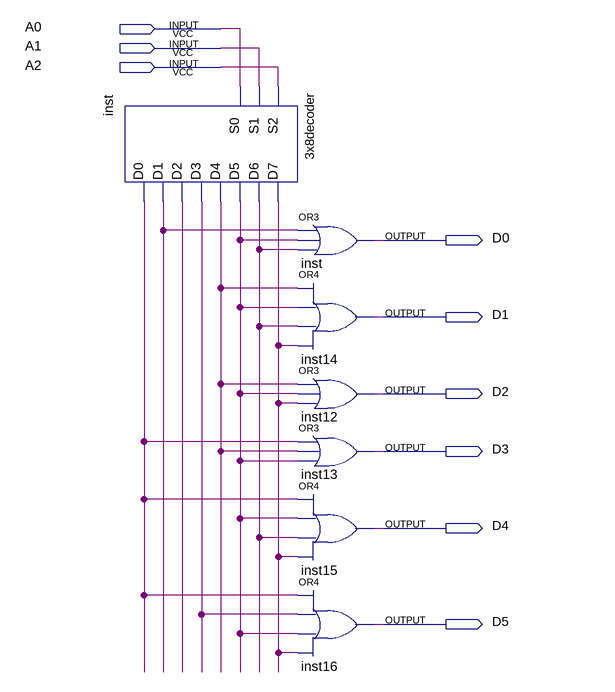
[diagram p0: schematic sheet]
// Quartus schematic hw13p6a.bdf as structural Verilog: 7 symbols, 9 pins
module hw13p6a (
  input  A0,
  input  A1,
  input  A2,
  output D0,
  output D1,
  output D2,
  output D3,
  output D4,
  output D5
);

  wire inst_d0, inst_d1, inst_d2, inst_d3, inst_d4, inst_d5, inst_d6, inst_d7;

  \3x8decoder  inst (
    .S2(A2), .S1(A1), .S0(A0), .D7(inst_d7), .D6(inst_d6), .D5(inst_d5), .D4(inst_d4), .D3(inst_d3),
    .D2(inst_d2), .D1(inst_d1), .D0(inst_d0));
  or inst_dup2 (D0, inst_d1, inst_d5, inst_d6);
  or inst14 (D1, inst_d4, inst_d5, inst_d6, inst_d7);
  or inst12 (D2, inst_d4, inst_d5, inst_d7);
  or inst13 (D3, inst_d0, inst_d4, inst_d5);
  or inst15 (D4, inst_d0, inst_d5, inst_d6, inst_d7);
  or inst16 (D5, inst_d0, inst_d3, inst_d5, inst_d7);
endmodule
